# EAGLE design hello (EAGLE 7.2.0)
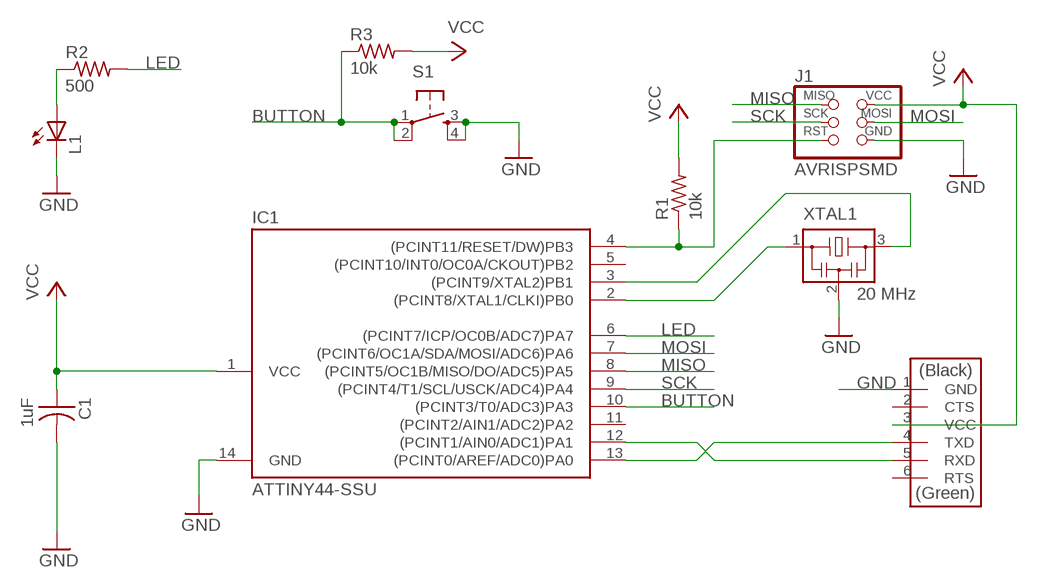
[diagram p0: schematic, sheet 1]

## Parts
C1  1uF  CAP-US1206  [C1206]
IC1  ATTINY44-SSU  [SOIC14]
J1  AVRISPSMD  [2X03SMD]
J2  FTDI  FTDI-SMD-HEADER  [1X06SMD]
L1  LEDFAB1206  [LED1206FAB]
R1  10k  RES-US1206  [R1206]
R2  500  RES-US1206  [R1206]
R3  10k  RES-US1206  [R1206]
S1  6MM_SWITCH6MM_SWITCH  [6MM_SWITCH]
XTAL1  20 MHz  RESONATOR  [EFOBM]

## Nets
BUTTON: IC1.10((PCINT3/T0/ADC3)PA3) R3.1 S1.1(P) S1.2(P1)
GND: C1.2 IC1.14(GND) J1.6(GND) J2.1(GND) L1.2(C) S1.3(S) S1.4(S1) XTAL1.2
LED: IC1.6((PCINT7/ICP/OC0B/ADC7)PA7) R2.2
MISO: IC1.8((PCINT5/OC1B/MISO/DO/ADC5)PA5) J1.1(MISO)
MOSI: IC1.7((PCINT6/OC1A/SDA/MOSI/ADC6)PA6) J1.4(MOSI)
N$1: L1.1(A) R2.1
N$3: IC1.3((PCINT9/XTAL2)PB1) XTAL1.3
N$4: IC1.2((PCINT8/XTAL1/CLKI)PB0) XTAL1.1
N$5: IC1.4((PCINT11/RESET/DW)PB3) J1.5(RST) R1.1
N$8: IC1.12((PCINT1/AIN0/ADC1)PA1) J2.5(RXD)
N$9: IC1.13((PCINT0/AREF/ADC0)PA0) J2.4(TXD)
SCK: IC1.9((PCINT4/T1/SCL/USCK/ADC4)PA4) J1.3(SCK)
VCC: C1.1 IC1.1(VCC) J1.2(VCC) J2.3(VCC) R1.2 R3.2
Unconnected: IC1.5((PCINT10/INT0/OC0A/CKOUT)PB2) IC1.11((PCINT2/AIN1/ADC2)PA2) J2.2(CTS) J2.6(RTS)

## Library data of the parts
C1 = fab:CAP-US
IC1 = fab:ATTINY44
J1 = fab:AVRISP
J2 = fab:FTDI-SMD-HEADER
L1 = fab:LED: LED
R1-R3 = fab:RES-US: Resistor (US Symbol) Variants with postfix FAB are widened to allow the routing of internal traces
S1 = fab:6MM_SWITCH: OMRON SWITCH
XTAL1 = fab:RESONATOR

## Board
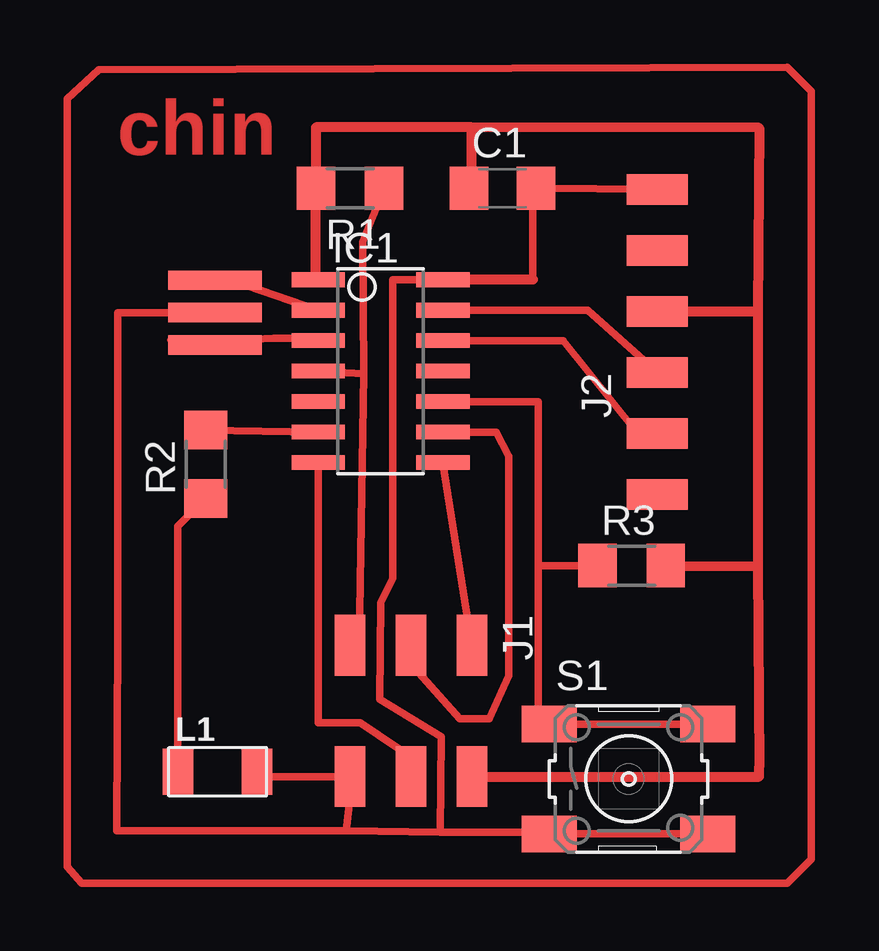
[diagram p1: board, top side]

No outline drawn. Coordinates in mm, seen from the top.
Copper layers (1*16): Top 0.035mm / dielectric 1.5mm / Bottom 0.035mm
Design rules "default *": minimum track width 10mil, minimum drill 24mil, track to track 12mil, track to pad 12mil, pad to pad 8mil, via to via 8mil, smd to smd 8mil, copper to edge 40mil, drill to drill 8mil, minimum pad ring 10mil, minimum via ring 8mil, stop-mask expansion 4mil, vias tented up to drill 0mil, thermal gap 10mil

### Footprints (pad centres in the part's own frame; a part is rotated, then mirrored left to right if it is on the bottom)
C1206 = smd 1.6 x 1.8: 1 -1.4,0; 2 1.4,0
SOIC14 = smd 0.61 x 2.21: 1 -3.81,-2.603; 2 -2.54,-2.603; 3 -1.27,-2.603; 4 0,-2.603; 5 1.27,-2.603; 6 2.54,-2.603; 7 3.81,-2.603; 8 3.81,2.603; 9 2.54,2.603; 10 1.27,2.603; 11 0,2.603; 12 -1.27,2.603; 13 -2.54,2.603; 14 -3.81,2.603
2X03SMD = smd 2.54 x 1.27: 1 -2.54,2.54; 2 2.92,2.54; 3 -2.54,0; 4 2.92,0; 5 -2.54,-2.54; 6 2.92,-2.54
1X06SMD = smd 2.54 x 1.27: 1 0,6.35; 2 0,3.81; 3 0,1.27; 4 0,-1.27; 5 0,-3.81; 6 0,-6.35
LED1206FAB = smd 1.27 x 1.905: 1 -1.651,0; 2 1.651,0
R1206 = smd 1.6 x 1.803: 1 -1.422,0; 2 1.422,0
6MM_SWITCH = smd 2.286 x 1.524: 1 -3.302,2.286; 2 3.302,2.286; 3 -3.302,-2.286; 4 3.302,-2.286
EFOBM = smd 0.8 x 3.9: 1 -1.35,0; 2 0,0; 3 1.35,0

### Placement (x,y rotation side)
C1  19.05,29.21 0 top
IC1  13.97,21.59 270 top
J1  15.24,7.62 270 top
J2  25.5,22.81 0 top
L1  7.18,4.9 0 top
R1  12.7,29.21 180 top
R2  6.69,17.71 90 top
R3  24.43,13.49 0 top
S1  24.31,4.6 0 top
XTAL1  7.08,24.03 270 top

### Tracks (layer width: path | path; a pad name or v marks a point on that pad's centre or on a via)
BUTTON
  Top 0.305: S1.2 S1.1 20.55,6.63 20.55,13.49 | 20.55,13.49 20.55,20.32 IC1.10 | R3.1 20.55,13.49
GND
  Top 0.254: C1.2 20.32,29.21 | 12.75,3.91 12.7,3.91
  Top 0.305: 20.32,29.21 20.32,25.4 | 16.46,2.39 16.51,6.35 13.95,7.92 13.97,11.94 14.48,12.95 14.48,25.4 IC1.14 | 12.7,3.91 12.55,2.44 | C1.2 J2.1 | 12.55,2.44 16.46,2.39 | 12.55,2.44 2.97,2.44 3.02,10.6 3.02,24.03 XTAL1.2 | 16.46,2.39 21.06,2.39 21.06,2.49 21.01,2.49 S1.3 S1.4 | L1.2 9.03,4.7 J1.6
  Top 0.406: 12.52,4.83 J1.6 12.75,4.6 12.75,3.91 | 20.32,25.4 IC1.14
LED
  Top 0.305: IC1.6 R2.2
MISO
  Top 0.305: IC1.8 J1.1
MOSI
  Top 0.305: IC1.7 11.37,6.93 13.13,6.93 15.49,5.33 15.49,4.95 J1.4
N$1
  Top 0.305: R2.1 5.53,15.13 L1.1
N$2
  Top 0.305: 0.92,32.95 2.22,34.15 30.92,34.25 31.92,33.25 31.92,1.25 30.92,0.25 1.52,0.25 0.92,0.95 0.92,32.95
N$3
  Top 0.254: 11.15,22.89 IC1.3 | 5.21,22.89 XTAL1.3
  Top 0.305: 11.15,22.89 arc19 XTAL1.3
N$4
  Top 0.305: 6.02,25.58 XTAL1.1 arc-55 8.42,25.15 IC1.2
N$5
  Top 0.254: 13.97,29.21 R1.1 14.22,29.21 | J1.5 13.08,10.29
  Top 0.305: 13.28,21.49 IC1.4 | 13.08,10.29 13.28,21.49 | 13.28,21.49 13.23,26.98 R1.1
N$8
  Top 0.305: IC1.12 21.59,22.86 24.64,19.05 J2.5
N$9
  Top 0.305: IC1.13 22.61,24.13 J2.4
SCK
  Top 0.254: 15.04,10.16 J1.3
  Top 0.305: 15.04,10.16 15.04,9.6 17.27,7.11 18.5,7.11 19.3,8.89 19.3,18.03 18.8,19.05 IC1.9
VCC
  Top 0.254: R1.2 11.37,29.21 | C1.1 17.78,29.21
  Top 0.305: 29.74,5.08 29.74,4.7
  Top 0.406: 17.78,31.75 29.74,31.73 29.69,24.08 | 17.78,31.75 11.28,31.75 R1.2 11.28,25.4 IC1.1 | 29.69,24.08 29.69,13.46 | 29.69,13.46 29.74,5.08 29.74,4.7 J1.2 | J2.3 29.69,24.08 | 17.78,29.21 17.78,31.75 | R3.2 29.69,13.46

### Text on the board
Top: chin